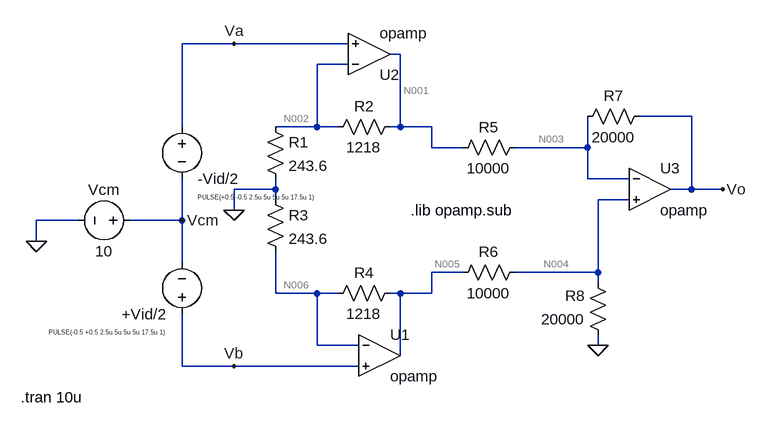
[diagram p0: schematic Spice1_1_1.8.4.asc]
Spice1_1_1.8.4.asc, the LTspice schematic file:
Version 4
SHEET 1 880 680
WIRE -32 64 -112 64
WIRE 144 64 -32 64
WIRE 224 80 208 80
WIRE 144 96 96 96
WIRE 672 176 592 176
WIRE -112 192 -112 64
WIRE 96 192 96 96
WIRE 96 192 32 192
WIRE 128 192 96 192
WIRE 224 192 224 80
WIRE 224 192 208 192
WIRE 272 192 224 192
WIRE 272 224 272 192
WIRE 320 224 272 224
WIRE 512 224 512 176
WIRE 512 224 400 224
WIRE 512 272 512 224
WIRE 576 272 512 272
WIRE 32 288 32 272
WIRE 32 288 -32 288
WIRE 672 288 672 176
WIRE 672 288 640 288
WIRE 720 288 672 288
WIRE 32 304 32 288
WIRE 576 304 528 304
WIRE -32 320 -32 288
WIRE -272 336 -336 336
WIRE -112 336 -112 272
WIRE -112 336 -192 336
WIRE -336 368 -336 336
WIRE -112 400 -112 336
WIRE 320 416 272 416
WIRE 528 416 528 304
WIRE 528 416 400 416
WIRE 528 432 528 416
WIRE 32 448 32 384
WIRE 96 448 32 448
WIRE 128 448 96 448
WIRE 224 448 208 448
WIRE 272 448 272 416
WIRE 272 448 224 448
WIRE 96 528 96 448
WIRE 160 528 96 528
WIRE 528 528 528 512
WIRE 224 544 224 448
WIRE -112 560 -112 480
WIRE -32 560 -112 560
WIRE 160 560 -32 560
FLAG 528 528 0
FLAG -32 320 0
FLAG -336 368 0
FLAG -32 560 Vb
FLAG 720 288 Vo
FLAG -32 64 Va
FLAG -112 336 Vcm
SYMBOL OpAmps\\opamp 192 480 R0
SYMATTR InstName U1
SYMBOL OpAmps\\opamp 608 224 R0
SYMATTR InstName U3
SYMBOL res 16 176 R0
SYMATTR InstName R1
SYMATTR Value 243.6
SYMBOL res 224 176 R90
WINDOW 0 0 56 VBottom 2
WINDOW 3 32 56 VTop 2
SYMATTR InstName R2
SYMATTR Value 1218
SYMBOL res 16 288 R0
SYMATTR InstName R3
SYMATTR Value 243.6
SYMBOL res 224 432 R90
WINDOW 0 0 56 VBottom 2
WINDOW 3 32 56 VTop 2
SYMATTR InstName R4
SYMATTR Value 1218
SYMBOL res 416 208 R90
WINDOW 0 0 56 VBottom 2
WINDOW 3 32 56 VTop 2
SYMATTR InstName R5
SYMATTR Value 10000
SYMBOL res 416 400 R90
WINDOW 0 0 56 VBottom 2
WINDOW 3 32 56 VTop 2
SYMATTR InstName R6
SYMATTR Value 10000
SYMBOL res 608 160 R90
WINDOW 0 0 56 VBottom 2
WINDOW 3 32 56 VTop 2
SYMATTR InstName R7
SYMATTR Value 20000
SYMBOL res 544 528 R180
WINDOW 0 36 76 Left 2
WINDOW 3 36 40 Left 2
SYMATTR InstName R8
SYMATTR Value 20000
SYMBOL voltage -112 496 R180
WINDOW 3 24 -12 Left 0
WINDOW 123 0 0 Left 0
WINDOW 39 0 0 Left 0
SYMATTR Value PULSE(-0.5 +0.5 2.5u 5u 5u 5u 17.5u 1)
SYMATTR InstName +Vid/2
SYMBOL voltage -112 176 R0
WINDOW 0 24 96 Left 2
WINDOW 3 24 124 Left 0
WINDOW 123 0 0 Left 0
WINDOW 39 0 0 Left 0
SYMATTR InstName -Vid/2
SYMATTR Value PULSE(+0.5 -0.5 2.5u 5u 5u 5u 17.5u 1)
SYMBOL voltage -176 336 R90
WINDOW 0 -32 56 VBottom 2
WINDOW 3 32 56 VTop 2
SYMATTR InstName Vcm
SYMATTR Value 10
SYMBOL OpAmps\\opamp 176 144 M180
SYMATTR InstName U2
TEXT 240 320 Left 2 !.lib opamp.sub
TEXT -360 608 Left 2 !.tran 10u

The netlist it stands for:
* Spice1_1_1.8.4.asc
XU1 N006 Vb N005 opamp Aol=100K GBW=10Meg  ; pins invin noninvin out
XU3 N003 N004 Vo opamp Aol=100K GBW=10Meg  ; pins invin noninvin out
R1 N002 0 243.6
R2 N001 N002 1218
R3 0 N006 243.6
R4 N005 N006 1218
R5 N003 N001 10000
R6 N004 N005 10000
R7 Vo N003 20000
R8 0 N004 20000
V§+Vid/2 Vb Vcm PULSE(-0.5 +0.5 2.5u 5u 5u 5u 17.5u 1)
V§-Vid/2 Va Vcm PULSE(+0.5 -0.5 2.5u 5u 5u 5u 17.5u 1)
Vcm Vcm 0 10
XU2 N002 Va N001 opamp Aol=100K GBW=10Meg  ; pins invin noninvin out
.lib opamp.sub
.tran 10u
.backanno
.end

* Results of the author's LTspice run, read from the files saved beside the schematic
* Operating Point, zero values left out:
*   V(n005) = 57 V
*   V(vb) = 9.5 V
*   V(n006) = 9.499 V
*   V(vo) = -12 V
*   V(n004) = 38 V
*   V(n003) = 38 V
*   V(n002) = 10.5 V
*   V(n001) = 63 V
*   V(vcm) = 10 V
*   V(va) = 10.5 V
*   I(R8) = -1.9 mA
*   I(R7) = -2.5 mA
*   I(R6) = -1.9 mA
*   I(R5) = -2.5 mA
*   I(R4) = 39 mA
*   I(R3) = -39 mA
*   I(R2) = 43.1 mA
*   I(R1) = 43.1 mA
*   Ix(u1:3) = -40.9 mA
*   Ix(u3:3) = 2.5 mA
*   Ix(u2:3) = -45.6 mA
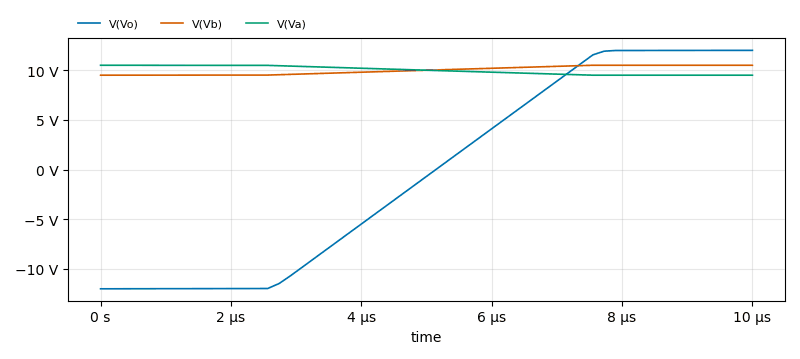
[diagram p1: Transient Analysis of Spice1_1_1.8.4.asc, plotted from the saved traces]
* Transient Analysis, 1 run:
*   V(Vo): min -12 V, max 12 V, average -342.4 mV, rms 10.26 V, last 12 V
*   V(Vb): min 9.5 V, max 10.5 V, average 10 V, rms 10.01 V, last 10.5 V
*   V(Va): min 9.5 V, max 10.5 V, average 10 V, rms 10.01 V, last 9.5 V